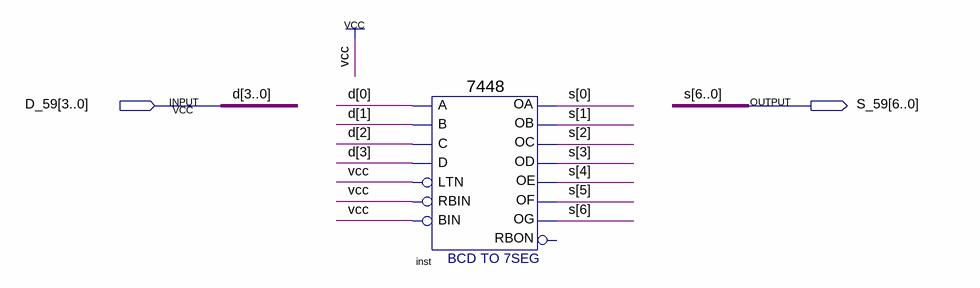
[diagram p0: schematic sheet]
// Quartus schematic decoder_59.bdf as structural Verilog: 1 symbols, 2 pins
module decoder_59 (
  input  [3:0] D_59,
  output [6:0] S_59
);

  \7448  inst (
    .A(D_59[0]), .C(D_59[2]), .D(D_59[3]), .B(D_59[1]), .RBIN(1'b1), .BIN(1'b1), .LTN(1'b1), .OC(S_59[2]),
    .OE(S_59[4]), .OD(S_59[3]), .OF(S_59[5]), .OG(S_59[6]), .OB(S_59[1]), .OA(S_59[0]));  // open: RBON

  // Other names for the same wires on the sheet: d[3:0] = D_59; s[6:0] = S_59
endmodule
